# EAGLE design jbee_jn_oben (EAGLE 5.11)
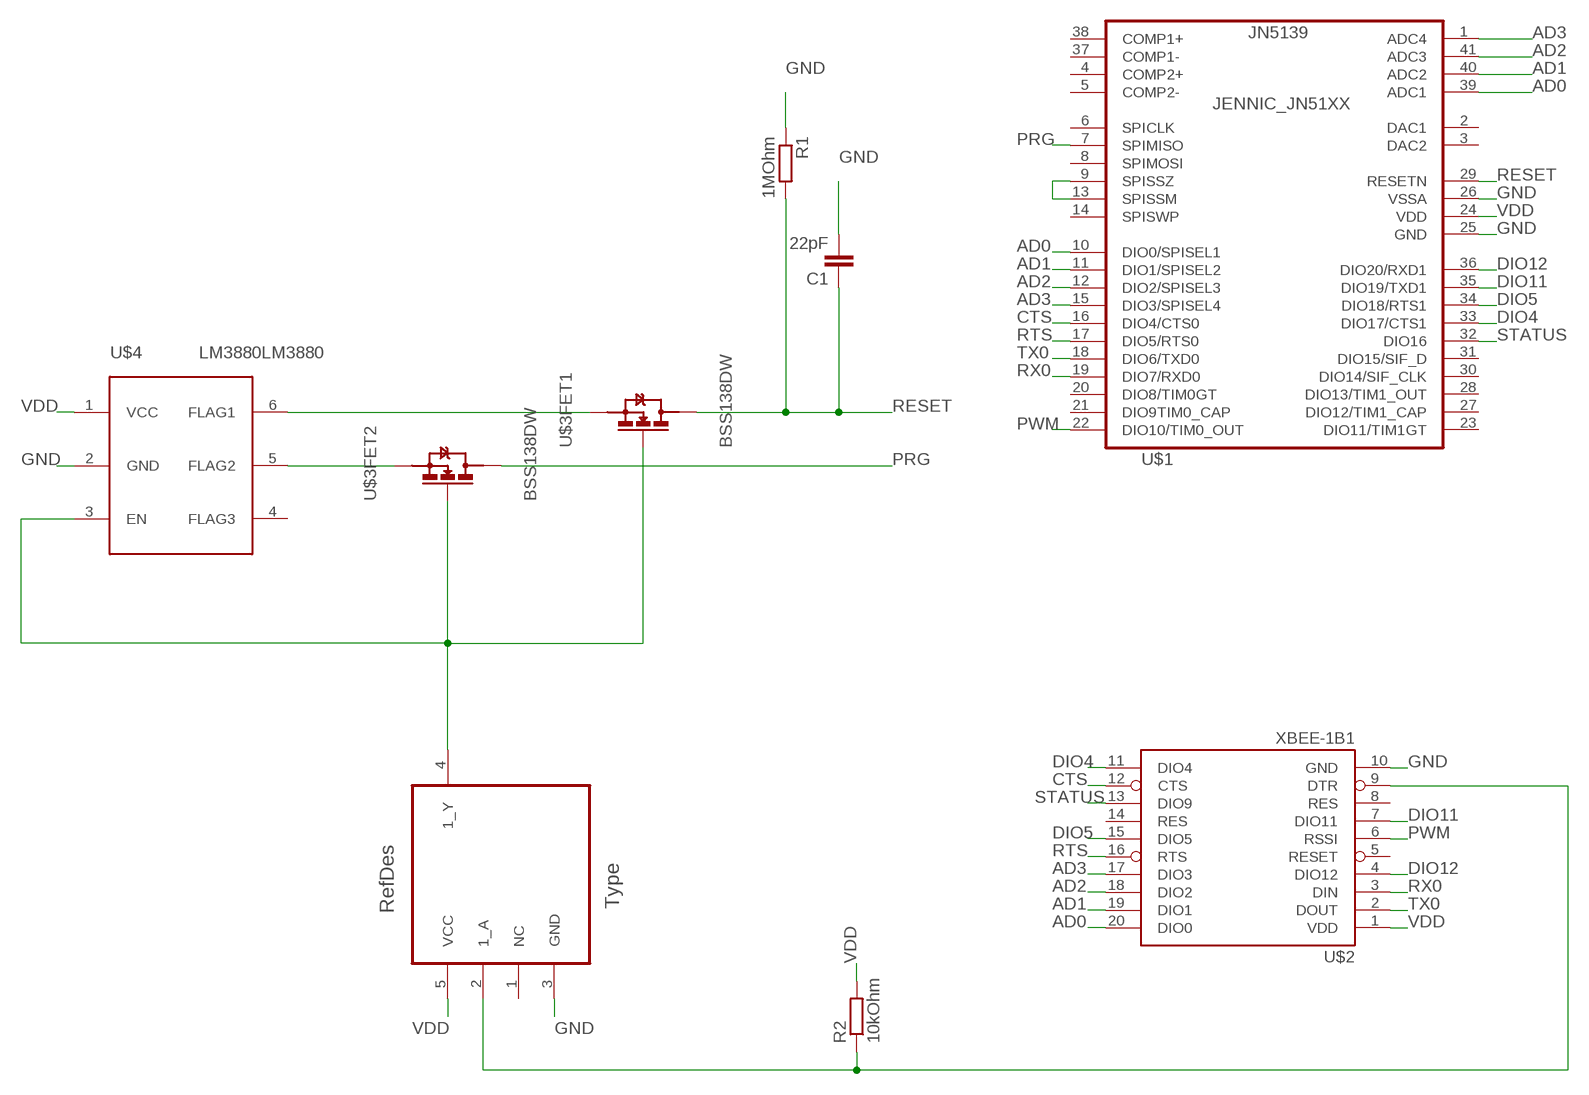
[diagram p0: schematic, sheet 1]

## Parts
C1  22pF  C-EUC0603  [C0603]
R1  1MOhm  R-EU_R0603  [R0603]
R2  10kOhm  R-EU_R0603  [R0603]
U1  74V1G14STR  [SOT95P290X145-5N]
U$1  JENNIC_JN51XX  [JN5139_SMD]
U$2  XBEE-1B1  [XBEE-1]
U$3  BSS138DW  [SOT-363]
U$4  LM3880LM3880  [SOT23-6]

## Nets
AD0: U$1.10(DIO0/SPISEL1) U$1.39(ADC1) U$2.20(DIO0)
AD1: U$1.11(DIO1/SPISEL2) U$1.40(ADC2) U$2.19(DIO1)
AD2: U$1.12(DIO2/SPISEL3) U$1.41(ADC3) U$2.18(DIO2)
AD3: U$1.1(ADC4) U$1.15(DIO3/SPISEL4) U$2.17(DIO3)
CTS: U$1.16(DIO4/CTS0) U$2.12(CTS)
DIO4: U$1.33(DIO17/CTS1) U$2.11(DIO4)
DIO5: U$1.34(DIO18/RTS1) U$2.15(DIO5)
DIO11: U$1.35(DIO19/TXD1) U$2.7(DIO11)
DIO12: U$1.36(DIO20/RXD1) U$2.4(DIO12)
GND: C1.2 R1.1 U1.3(GND) U$1.25(GND) U$1.26(VSSA) U$2.10(GND) U$4.2(GND)
N$1: U$3.4(FET1:S) U$4.6(FLAG1)
N$2: U1.4(1_Y) U$3.2(FET2:G) U$3.5(FET1:G) U$4.3(EN)
N$7: U$1.9(SPISSZ) U$1.13(SPISSM)
N$11: U$3.1(FET2:S) U$4.5(FLAG2)
N$12: R2.1 U1.2(1_A) U$2.9(DTR)
PRG: U$1.7(SPIMISO) U$3.6(FET2:D)
PWM: U$1.22(DIO10/TIM0_OUT) U$2.6(RSSI)
RESET: C1.1 R1.2 U$1.29(RESETN) U$3.3(FET1:D)
RTS: U$1.17(DIO5/RTS0) U$2.16(RTS)
RX0: U$1.19(DIO7/RXD0) U$2.3(DIN)
STATUS: U$1.32(DIO16) U$2.13(DIO9)
TX0: U$1.18(DIO6/TXD0) U$2.2(DOUT)
VDD: R2.2 U1.5(VCC) U$1.24(VDD) U$2.1(VDD) U$4.1(VCC)
Unconnected: U1.1(NC) U$1.2(DAC1) U$1.3(DAC2) U$1.4(COMP2+) U$1.5(COMP2-) U$1.6(SPICLK) U$1.8(SPIMOSI) U$1.14(SPISWP) U$1.20(DIO8/TIM0GT) U$1.21(DIO9TIM0_CAP) U$1.23(DIO11/TIM1GT) U$1.27(DIO12/TIM1_CAP) U$1.28(DIO13/TIM1_OUT) U$1.30(DIO14/SIF_CLK) U$1.31(DIO15/SIF_D) U$1.37(COMP1-) U$1.38(COMP1+) U$2.5(RESET) U$2.8(RES) U$2.14(RES) U$4.4(FLAG3)

## Library data of the parts
C1 = rcl:C-EU: CAPACITOR, European symbol
R1 R2 = rcl:R-EU_: RESISTOR, European symbol
U1 = inverter:74V1G14STR; DESCRIPTION: SINGLE SCHMITT INVERTER; MPN: 74V1G14STR; OC_FARNELL: 1288476; OC_NEWARK: 89K1197; PACKAGE: SOT-23-5; SUPPLIER: STMICROELECTRONICS
U$1 = jnode:JENNIC_JN51XX: JN5139-xxx-M00xxx, Farnell: 1500175
U$2 = SparkFun:XBEE-1
U$3 = sonder_b:BSS138DW: BSS138DW DUAL N-CHANNEL ENHANCEMENT MODE FIELD EFFECT TRANSISTOR SOT-363 Package
U$4 = lm3881:LM3880

## Board
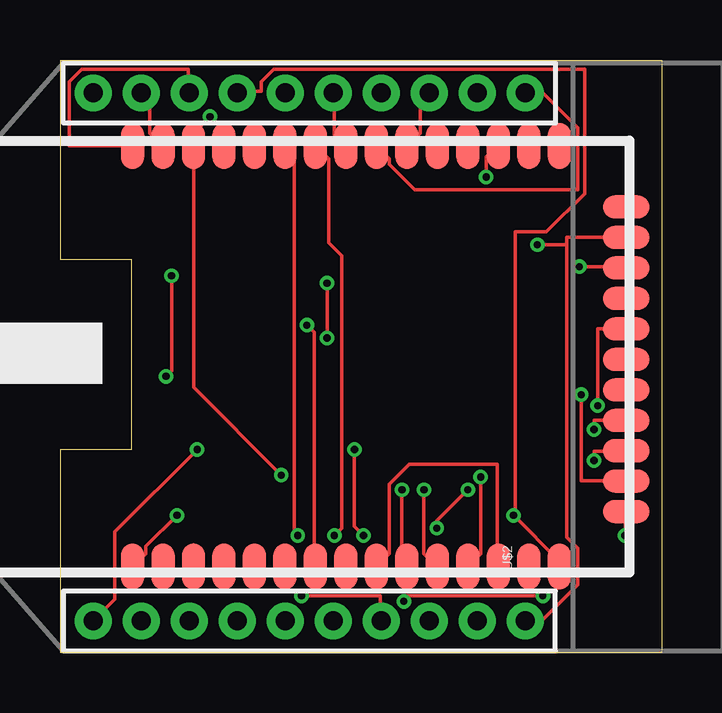
[diagram p1: board, top side]
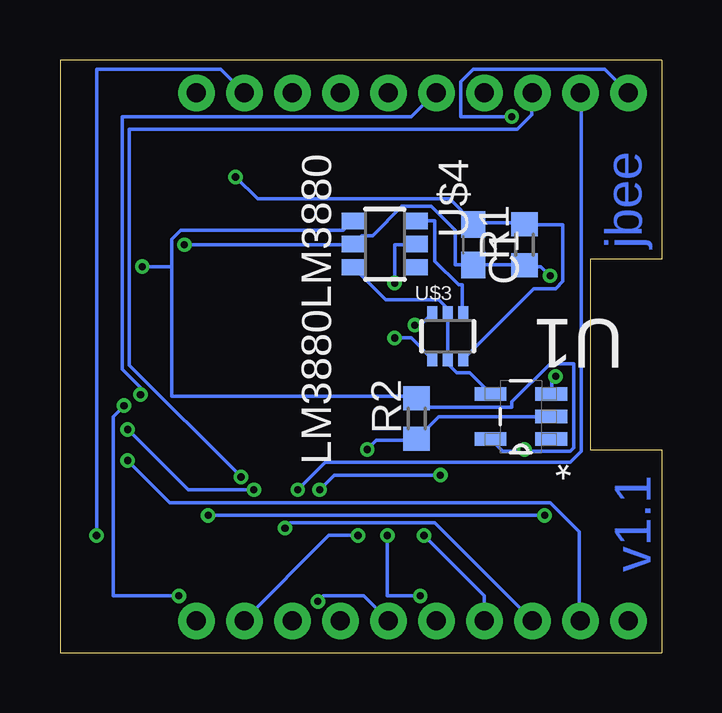
[diagram p2: board, bottom side, seen from below]

Size 25.07 x 24.69 mm. Coordinates in mm from the lower left corner, seen from the top.
Outline: 0,24.69 25.07,24.69 25.07,0 0,0 0,8.46 2.97,8.46 2.97,16.38 0,16.38 0,24.69
Copper layers (1*16): Top 0.035mm / dielectric 1.5mm / Bottom 0.035mm
Design rules "PCB-POOL Standard *": minimum track width 0.15mm, minimum drill 0.3mm, track to track 0.15mm, track to pad 0.15mm, pad to pad 0.15mm, via to via 0.15mm, smd to smd 0.15mm, copper to edge 0.3mm, drill to drill 0.2mm, minimum pad ring 0.2mm, minimum via ring 0.15mm, stop-mask expansion 0.075mm, vias tented up to drill 15mil, thermal gap 0.2mm

### Footprints (pad centres in the part's own frame; a part is rotated, then mirrored left to right if it is on the bottom)
C0603 = smd 1.1 x 1: 1 -0.85,0; 2 0.85,0
R0603 = smd 1 x 1.1: 1 -0.85,0; 2 0.85,0
SOT95P290X145-5N = smd 1.321 x 0.559: 1 -1.27,0.94; 2 -1.27,0; 3 -1.27,-0.94; 4 1.27,-0.94; 5 1.27,0.94
JN5139_SMD = smd 1.93 x 0.965: 1 0,0; 2 0,-1.27; 3 0,-2.54; 4 0,-3.81; 5 0,-5.08; 6 0,-6.35; 7 0,-7.62; 8 0,-8.89; 9 0,-10.16; 10 0,-11.43; 11 0,-12.7; 12 0,-13.97; 13 0,-15.24; 14 0,-16.51; 15 0,-17.78; 27 17.526,-17.78; 28 17.526,-16.51; 29 17.526,-15.24; 30 17.526,-13.97; 31 17.526,-12.7; 32 17.526,-11.43; 33 17.526,-10.16; 34 17.526,-8.89; 35 17.526,-7.62; 36 17.526,-6.35; 37 17.526,-5.08; 38 17.526,-3.81; 39 17.526,-2.54; 40 17.526,-1.27; 41 17.526,0 | smd 0.965 x 1.93: 16 2.286,-20.574; 17 3.556,-20.574; 18 4.826,-20.574; 19 6.096,-20.574; 20 7.366,-20.574; 21 8.636,-20.574; 22 9.906,-20.574; 23 11.176,-20.574; 24 12.446,-20.574; 25 13.716,-20.574; 26 14.986,-20.574
XBEE-1 = drill 0.8 pad 1.524 round: 1 -11,20; 2 -11,18; 3 -11,16; 4 -11,14; 5 -11,12; 6 -11,10; 7 -11,8; 8 -11,6; 9 -11,4; 10 -11,2; 11 11,2; 12 11,4; 13 11,6; 14 11,8; 15 11,10; 16 11,12; 17 11,14; 18 11,16; 19 11,18; 20 11,20
SOT-363 = smd 0.42 x 0.6: 1 -0.65,-0.95; 2 0,-0.95; 3 0.65,-0.95; 4 0.65,0.95; 5 0,0.95; 6 -0.65,0.95
SOT23-6 = smd 0.686 x 0.991: 1 -0.965,-1.321; 2 0,-1.321; 3 0.965,-1.321; 4 0.965,1.27; 5 0,1.27; 6 -0.965,1.27

### Placement (x,y rotation side)
C1  7.85,16.99 270 bottom
R1  5.72,16.99 90 bottom
R2  10.21,9.75 90 bottom
U1  5.87,9.83 180 bottom
U$1  3.02,3.58 90 top
U$2  21.39,12.32 90 top
U$3  8.92,13.18 0 bottom
U$4  11.51,17.02 270 bottom

### Tracks (layer width: path | path; a pad name or v marks a point on that pad's centre or on a via)
AD0  (via drill 0.3)
  Top 0.15: v14.25,6.78 14.25,3.73 14.4,3.58 U$1.10 | v9.22,7.39 5.56,11.05 U$1.39 5.56,21.64 v6.25,22.33
  Bottom 0.15: v14.25,6.78 13.64,7.39 v9.22,7.39 | v6.25,22.33 8.38,22.33 8.38,23.77 7.85,24.31 2.36,24.31 1.45,23.39 U$2.20
AD1  (via drill 0.3)
  Top 0.15: U$1.40 4.27,21.11 3.73,21.64 3.73,23.01 3.43,23.32 U$2.19 | v15.16,6.78 15.16,4.12 15.7,3.58 U$1.11
  Bottom 0.15: v15.16,6.78 14.02,7.93 3.81,7.93 3.35,8.38 3.35,23.32 U$2.19
AD2  (via drill 0.3)
  Top 0.15: U$1.41 0.38,21.11 0.38,23.77 0.91,24.31 5.33,24.31 5.33,23.39 U$2.18 | U$1.12 17.53,4.12 v17.53,7.32
  Bottom 0.15: v17.53,7.32 22.17,11.96 22.17,21.79 6.02,21.79 5.41,22.4 5.41,23.32 U$2.18
AD3  (via drill 0.3)
  Top 0.15: v4.88,5.72 3.58,4.42 3.58,4.12 3.05,3.58 U$1.1 | U$1.15 20.8,3.81 v18.9,5.72 18.97,5.72 18.97,17.53 20.27,17.53 21.87,19.13 21.87,24.31 8.92,24.31 8.38,23.77 8.38,23.39 7.39,23.39 U$2.17
  Bottom 0.15: v4.88,5.72 v18.9,5.72
CTS  (via drill 0.3)
  Top 0.15: v23.55,4.88 23.55,5.87 U$1.16
  Bottom 0.15: v23.55,4.88 23.55,24.31 18.36,24.31 17.45,23.39 U$2.12
DIO4
  Top 0.15: U$1.33 13.72,20.57 13.72,20.35 14.78,19.28 21.56,19.28 21.56,21.87 20.12,23.32 19.43,23.32 U$2.11
DIO5
  Top 0.15: U$1.34 11.89,21.11 11.43,21.56 11.43,23.32 U$2.15
DIO11  (via drill 0.3)
  Top 0.15: v11.43,4.88 11.73,5.18 11.73,16.54 11.2,17.07 11.2,20.57 10.67,21.11 U$1.35 | v10.06,2.36 13.33,2.36 13.33,1.37 U$2.7
  Bottom 0.15: v11.43,4.88 11.43,2.36 v10.06,2.36
DIO12  (via drill 0.3)
  Top 0.15: U$1.36 9.75,20.73 9.75,5.03 v9.91,4.88
  Bottom 0.15: v9.91,4.88 7.39,2.36 7.39,1.37 U$2.4
GND  (via drill 0.3)
  Top 0.15: v4.42,11.51 4.65,11.74 v4.65,15.7 | U$1.26 23.62,18.52 23.62,17.3 U$1.25 21.11,17.3 21.11,16.99 | 21.11,16.99 21.11,4.8 21.56,4.34 21.56,2.82 20.12,1.37 19.43,1.37 U$2.10 | v19.89,16.99 21.11,16.99
  Bottom 0.15: C1.2 8.61,16.15 8.61,17.6 9.6,18.59 10.82,18.59 12.04,17.37 12.5,17.37 12.8,17.07 U$4.2 12.88,16.99 v19.89,16.99 | C1.2 R1.1 5.71,16.08 5.03,16.08 v4.65,15.7 | C1.2 | v4.42,11.51 4.57,11.51 4.57,10.82 U1.3
N$1
  Bottom 0.15: U$3.4 8.31,14.17 8.31,15.32 8.46,15.32 9.45,16.31 9.45,17.98 U$4.6
N$2
  Bottom 0.15: U$4.3 12.8,16 11.51,14.71 9.3,14.71 8.92,14.33 U$3.5 U$3.2 8.92,12.04 8.53,11.66 8,11.66 7.16,10.82 U1.4
N$7
  Top 0.15: U$1.9 13.72,4.12 13.72,7.01 14.55,7.85 18.21,7.85 18.21,3.58 U$1.13
N$11  (via drill 0.3)
  Top 0.15: v11.13,13.11 v11.13,15.39
  Bottom 0.15: v11.13,13.11 10.44,13.11 9.6,12.27 U$3.1 | v11.13,15.39 11.13,16.99 10.29,16.99 U$4.5
N$12  (via drill 0.3)
  Top 0.15: v12.65,4.88 12.27,5.26 v12.27,8.46
  Bottom 0.15: U1.2 9.3,9.83 R2.1 10.21,8.84 11.89,8.84 v12.27,8.46 | v12.65,4.88 13.87,4.88 17.37,1.37 U$2.9
PRG  (via drill 0.3)
  Top 0.15: v10.29,13.64 10.59,13.34 10.59,3.58 U$1.7
  Bottom 0.15: v10.29,13.64 10.06,13.64 9.6,14.1 U$3.6
PWM  (via drill 0.3)
  Top 0.15: v22.4,10.29 22.4,13.49 U$1.22 | v20.12,2.36 14.33,2.36 v14.33,2.13
  Bottom 0.15: v22.4,10.29 22.86,9.83 22.86,2.36 v20.12,2.36 | v14.33,2.13 14.1,2.36 12.42,2.36 11.43,1.37 U$2.6
RESET  (via drill 0.3)
  Top 0.15: v17.75,19.81 17.75,20.65 18.21,21.11 U$1.29
  Bottom 0.15: U$3.3 8.23,12.27 5.33,15.16 4.42,15.16 4.11,15.47 4.11,17.83 5.71,17.83 R1.2 5.71,17.91 7.85,17.91 | v17.75,19.81 16.84,18.9 8.84,18.9 7.85,17.91 | 7.85,17.91 C1.1
RTS  (via drill 0.3)
  Top 0.15: v21.72,10.74 21.72,7.16 23.55,7.16 U$1.17
  Bottom 0.15: v21.72,10.74 21.72,11.05 22.48,11.81 22.48,22.33 10.44,22.33 9.45,23.32 U$2.16
RX0  (via drill 0.3)
  Top 0.15: v22.25,9.3 22.25,9.68 U$1.19 | v16.99,6.78 15.7,5.49 v15.7,5.18
  Bottom 0.15: v22.25,9.3 19.74,6.78 v16.99,6.78 | v15.7,5.18 15.47,5.41 9.45,5.41 5.41,1.37 U$2.3
STATUS
  Top 0.15: U$1.32 14.48,21.11 15.01,21.64 15.01,23.01 15.32,23.32 U$2.13
TX0  (via drill 0.3)
  Top 0.15: v22.25,8 22.25,8.38 23.55,8.38 U$1.18
  Bottom 0.15: v22.25,8 20.5,6.25 4.65,6.25 3.43,5.03 3.43,1.37 U$2.2
VDD  (via drill 0.3)
  Top 0.15: v21.64,16.08 23.55,16.08 U$1.24 | v5.71,8.46 2.29,5.03 2.29,2.21 1.45,1.37 U$2.1
  Bottom 0.15: 20.42,16.08 20.42,10.67 10.21,10.67 R2.2 10.21,10.59 9.83,10.21 6.25,10.21 6.25,10.44 4.65,12.04 3.66,12.04 3.66,8.53 3.81,8.38 5.71,8.38 | 20.42,16.08 20.42,17.22 20.04,17.6 13.26,17.6 12.88,17.98 U$4.1 | 5.71,8.38 6.63,8.38 U1.5 | 20.42,16.08 v21.64,16.08 | v5.71,8.46 5.71,8.38

### Text on the board
Bottom: jbee | v1.1